# EAGLE design Sigfox_TH_sensor_v1.1 (EAGLE 9.6.2)
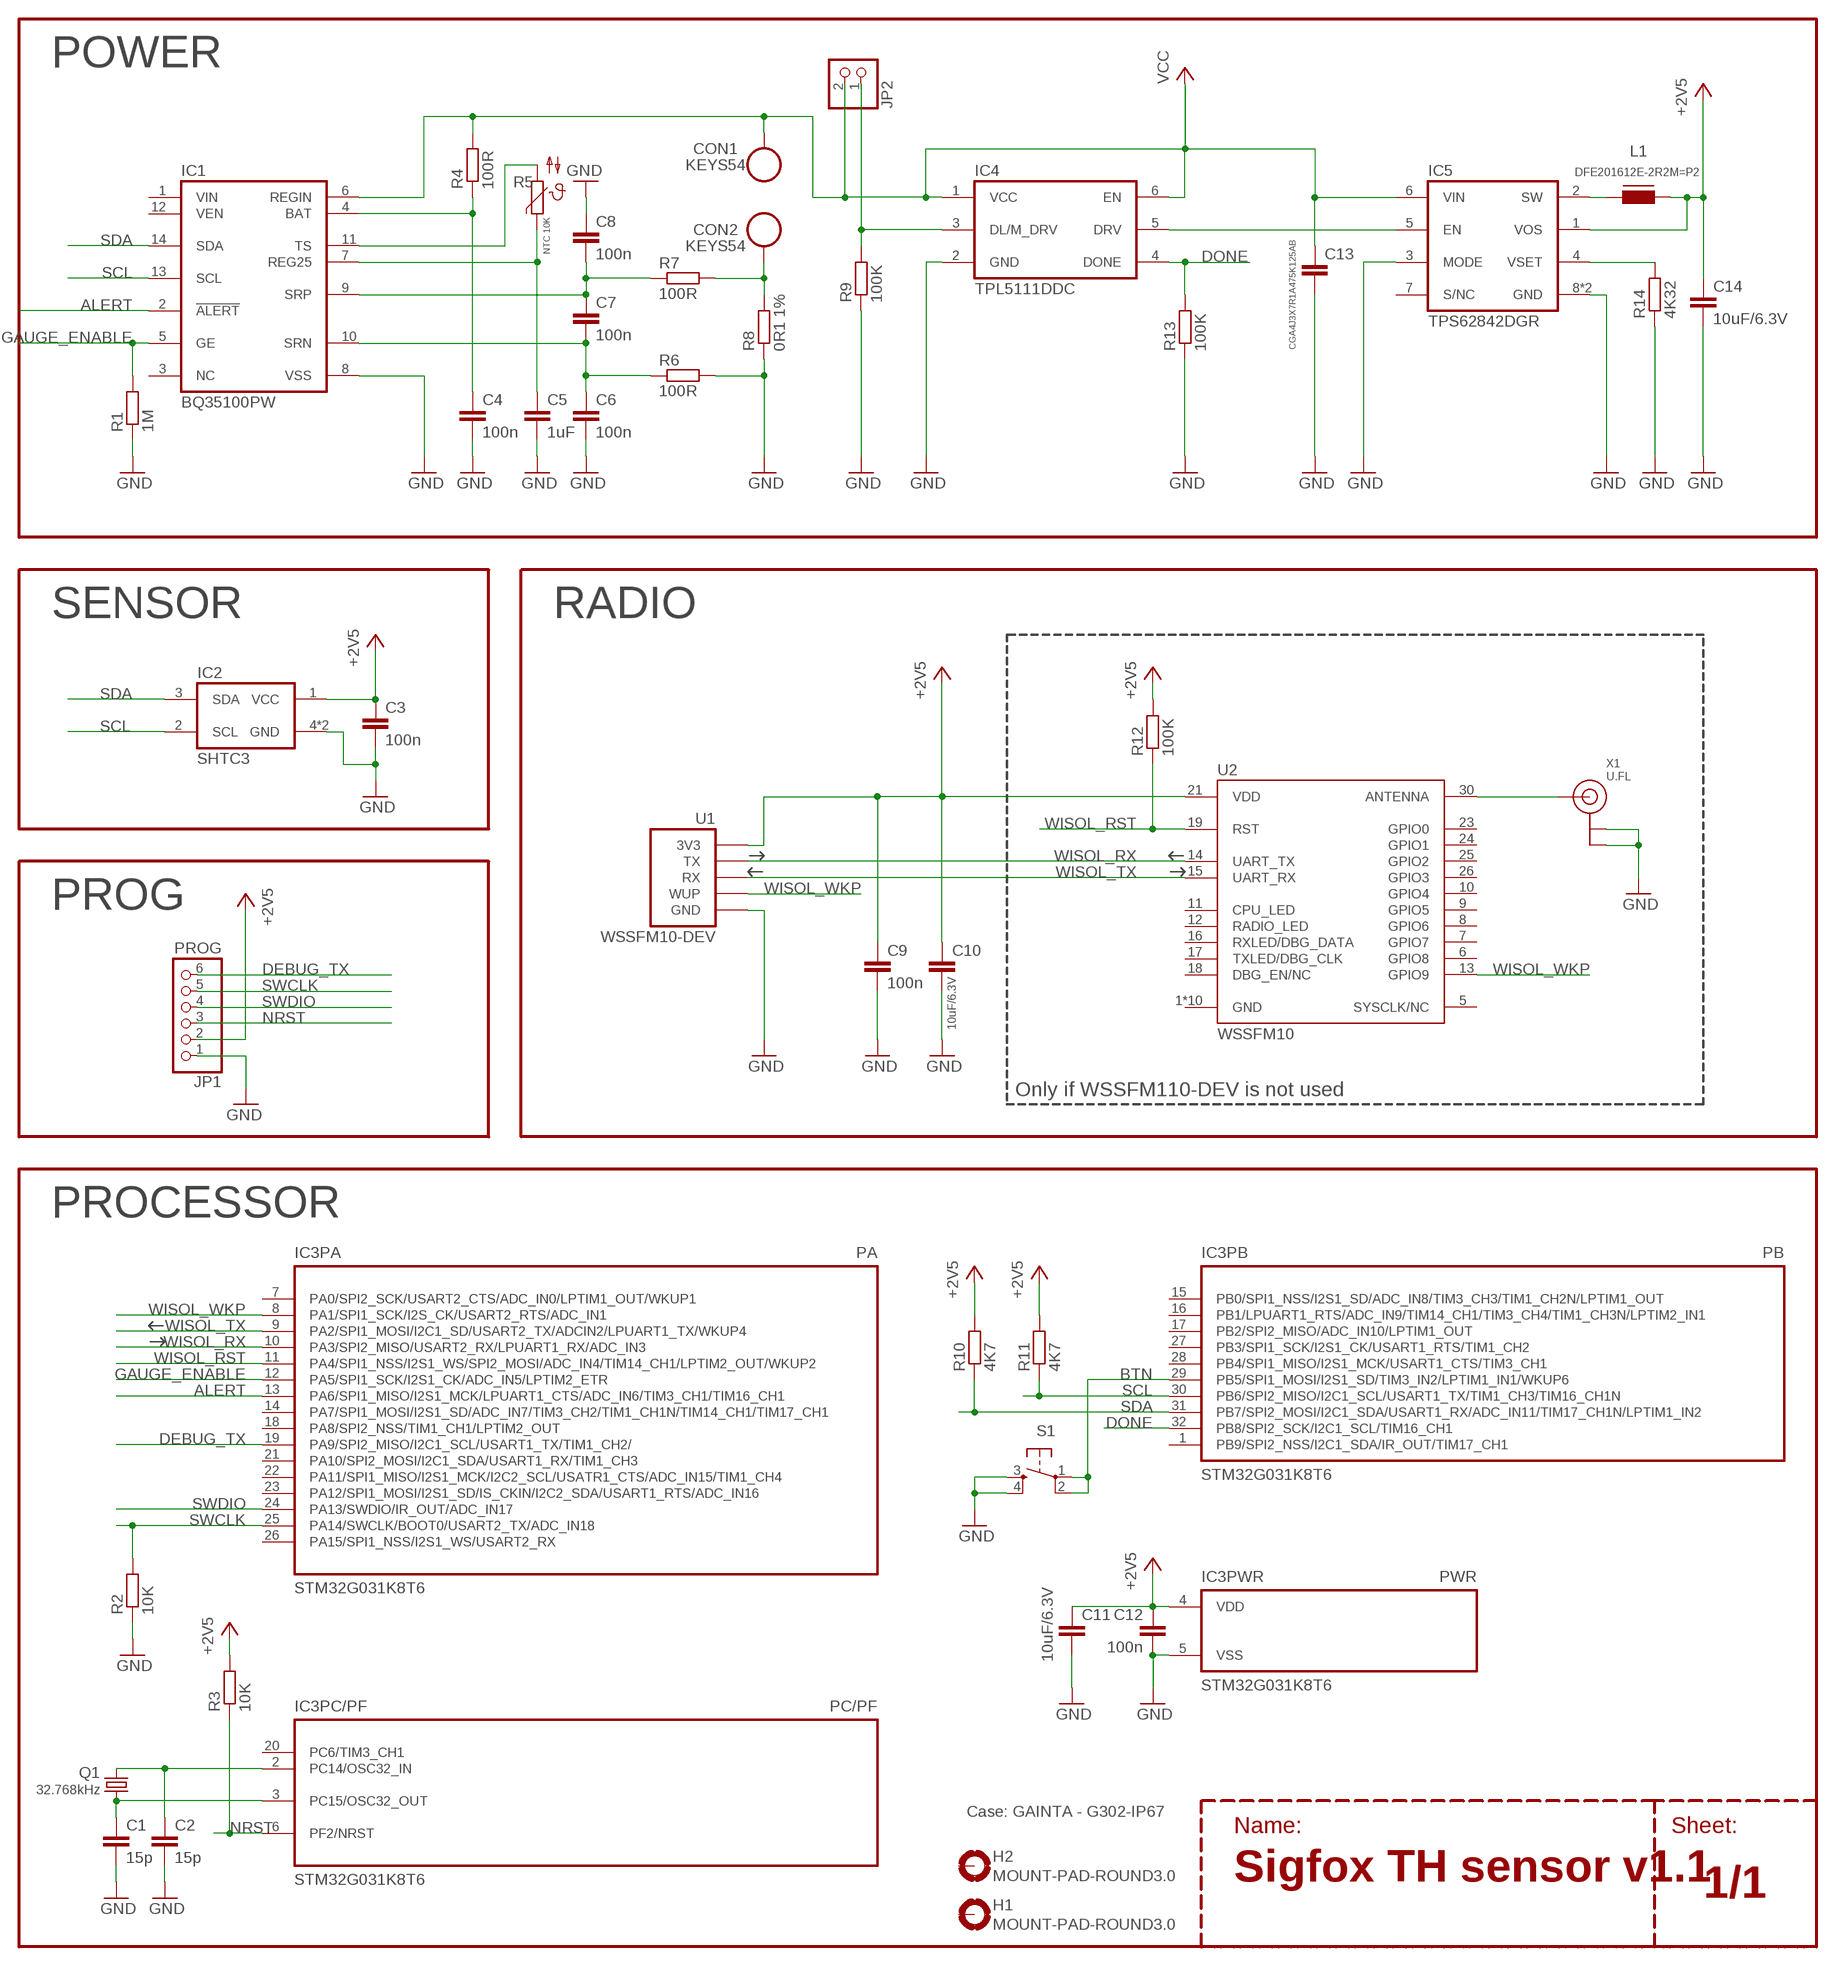
[diagram p0: schematic, sheet 1]

## Parts
C1  15p  C-EUC0805  [C0805]
C2  15p  C-EUC0805  [C0805]
C3  100n  C-EUC0805  [C0805]
C4  100n  C-EUC0805  [C0805]
C5  1uF  C-EUC0805  [C0805]
C6  100n  C-EUC0805  [C0805]
C7  100n  C-EUC0805  [C0805]
C8  100n  C-EUC0805  [C0805]
C9  100n  C-EUC0805  [C0805]
C10  10uF/6.3V  C-EUC0805  [C0805]
C11  10uF/6.3V  C-EUC0805  [C0805]
C12  100n  C-EUC0805  [C0805]
C13  CGA4J3X7R1A475K125AB  C-EUC0805  [C0805]
C14  10uF/6.3V  C-EUC0805  [C0805]
CON1  KEYS54  [KEYS54]
CON2  KEYS54  [KEYS54]
H1  MOUNT-PAD-ROUND3.0  [3,0-PAD]
H2  MOUNT-PAD-ROUND3.0  [3,0-PAD]
IC1  BQ35100PW  [TSSOP14]
IC2  SHTC3  [SON100P200X200X75-5T70X160N]
IC3  STM32G031K8T6  STM32G031  [TQFP32-08]
IC4  TPL5111DDC  [SOT23-6]
IC5  TPS62842DGR  [GHI-IC_MSOP-POWER.PAD-8(TI)]
JP1  PROG  PINHD-1X06_2.54-S  [1X06-S]
JP2  PINHD-1X02_2.00  [1X02M]
L1  DFE201612E-2R2M=P2  LQH2MPN2R2MGRL  [0806]
Q1  32.768kHz  CRYSTALMM20SS  [MM20SS]
R1  1M  R-EU_R0805  [R0805]
R2  10K  R-EU_R0805  [R0805]
R3  10K  R-EU_R0805  [R0805]
R4  100R  R-EU_R0805  [R0805]
R5  NTC 10K  NTCM-HP-10K-1%  [NTCM-HP]
R6  100R  R-EU_R0805  [R0805]
R7  100R  R-EU_R0805  [R0805]
R8  0R1 1%  R-EU_R1206  [R1206]
R9  100K  R-EU_R0805  [R0805]
R10  4K7  R-EU_R0805  [R0805]
R11  4K7  R-EU_R0805  [R0805]
R12  100K  R-EU_R0805  [R0805]
R13  100K  R-EU_R0805  [R0805]
R14  4K32  R-EU_R0805  [R0805]
S1  TACT_SWITCH-6X6X10-PTH  [TACTILE-6X6-PTH]
U1  WSSFM10-DEV  [WSSFM10-DEV]
U2  WSSFM10  [WSSFM10]
X1  U.FL  ANTENNA_U.FL  [U.FL]

## Nets
+2V5 [500mA]: C3.1 C9.1 C10.1 C11.1 C12.1 C14.1 IC2.1(VCC) IC3.4(PWR:VDD) IC5.1(VOS) JP1.2 L1.1 R3.2 R10.2 R11.2 R12.2 U1.3V3 U2.21(VDD)
ALERT: IC1.2(!ALERT!) IC3.13(PA:PA6/SPI1_MISO/I2S1_MCK/LPUART1_CTS/ADC_IN6/TIM3_CH1/TIM16_CH1)
BQ_2V5: C5.1 IC1.7(REG25) R5.1
BTN: IC3.29(PB:PB5/SPI1_MOSI/I2S1_SD/TIM3_IN2/LPTIM1_IN1/WKUP6) S1.1 S1.2
DEBUG_TX: IC3.19(PA:PA9/SPI2_MISO/I2C1_SCL/USART1_TX/TIM1_CH2/) JP1.6
DONE: IC3.32(PB:PB8/SPI2_SCK/I2C1_SCL/TIM16_CH1) IC4.4(DONE) R13.2
GAUGE_ENABLE: IC1.5(GE) IC3.12(PA:PA5/SPI1_SCK/I2S1_CK/ADC_IN5/LPTIM2_ETR) R1.2
GND: C1.2 C2.2 C3.2 C4.2 C5.2 C6.2 C8.1 C9.2 C10.2 C11.2 C12.2 C13.2 C14.2 IC1.8(VSS) IC2.4(GND) IC2.5(GND) IC3.5(PWR:VSS) IC4.2(GND) IC5.3(MODE) IC5.8(GND) IC5.9(GND) JP1.1 R1.1 R2.1 R6.2 R8.1 R9.1 R13.1 R14.1 S1.3 S1.4 U1.GND X1.1(GND) X1.2(GND)
N$1: IC5.4(VSET) R14.2
N$2: IC4.3(DL/M_DRV) JP2.1 R9.2
N$3: IC5.2(SW) L1.2
N$4: U2.30(ANTENNA) X1.3(SIGNAL)
N$6: C1.1 IC3.3(PC/PF:PC15/OSC32_OUT) Q1.4
N$7: IC4.5(DRV) IC5.5(EN)
N$8: C7.1 C8.2 IC1.9(SRP) R7.1
N$11: C6.1 C7.2 IC1.10(SRN) R6.1
N$12: C2.1 IC3.2(PC/PF:PC14/OSC32_IN) Q1.1
N$13: IC1.11(TS) R5.2
N$15: C4.1 IC1.4(BAT) R4.1
NRST: IC3.6(PC/PF:PF2/NRST) JP1.3 R3.1
PACK+: C13.1 CON1.1@0 CON1.1@1 CON1.1@2 IC1.6(REGIN) IC4.1(VCC) IC4.6(EN) IC5.6(VIN) JP2.2 R4.2 ; supply symbol labelled VCC
PACK-: CON2.1@0 CON2.1@1 CON2.1@2 R7.2 R8.2
SCL: IC1.13(SCL) IC2.2(SCL) IC3.30(PB:PB6/SPI2_MISO/I2C1_SCL/USART1_TX/TIM1_CH3/TIM16_CH1N) R11.1
SDA: IC1.14(SDA) IC2.3(SDA) IC3.31(PB:PB7/SPI2_MOSI/I2C1_SDA/USART1_RX/ADC_IN11/TIM17_CH1N/LPTIM1_IN2) R10.1
SWCLK: IC3.25(PA:PA14/SWCLK/BOOT0/USART2_TX/ADC_IN18) JP1.5 R2.2
SWDIO: IC3.24(PA:PA13/SWDIO/IR_OUT/ADC_IN17) JP1.4
WISOL_RST: IC3.11(PA:PA4/SPI1_NSS/I2S1_WS/SPI2_MOSI/ADC_IN4/TIM14_CH1/LPTIM2_OUT/WKUP2) R12.1 U2.19(RST)
WISOL_RX: IC3.10(PA:PA3/SPI2_MISO/USART2_RX/LPUART1_RX/ADC_IN3) U1.TX U2.14(UART_TX)
WISOL_TX: IC3.9(PA:PA2/SPI1_MOSI/I2C1_SD/USART2_TX/ADCIN2/LPUART1_TX/WKUP4) U1.RX U2.15(UART_RX)
WISOL_WKP: IC3.8(PA:PA1/SPI1_SCK/I2S_CK/USART2_RTS/ADC_IN1) U1.WUP U2.13(GPIO9)
Unconnected: H1.B3,0(MOUNT) H2.B3,0(MOUNT) IC1.1(VIN) IC1.3(NC) IC1.12(VEN) IC3.1(PB:PB9/SPI2_NSS/I2C1_SDA/IR_OUT/TIM17_CH1) IC3.7(PA:PA0/SPI2_SCK/USART2_CTS/ADC_IN0/LPTIM1_OUT/WKUP1) IC3.14(PA:PA7/SPI1_MOSI/I2S1_SD/ADC_IN7/TIM3_CH2/TIM1_CH1N/TIM14_CH1/TIM17_CH1) IC3.15(PB:PB0/SPI1_NSS/I2S1_SD/ADC_IN8/TIM3_CH3/TIM1_CH2N/LPTIM1_OUT) IC3.16(PB:PB1/LPUART1_RTS/ADC_IN9/TIM14_CH1/TIM3_CH4/TIM1_CH3N/LPTIM2_IN1) IC3.17(PB:PB2/SPI2_MISO/ADC_IN10/LPTIM1_OUT) IC3.18(PA:PA8/SPI2_NSS/TIM1_CH1/LPTIM2_OUT) IC3.20(PC/PF:PC6/TIM3_CH1) IC3.21(PA:PA10/SPI2_MOSI/I2C1_SDA/USART1_RX/TIM1_CH3) IC3.22(PA:PA11/SPI1_MISO/I2S1_MCK/I2C2_SCL/USATR1_CTS/ADC_IN15/TIM1_CH4) IC3.23(PA:PA12/SPI1_MOSI/I2S1_SD/IS_CKIN/I2C2_SDA/USART1_RTS/ADC_IN16) IC3.26(PA:PA15/SPI1_NSS/I2S1_WS/USART2_RX) IC3.27(PB:PB3/SPI1_SCK/I2S1_CK/USART1_RTS/TIM1_CH2) IC3.28(PB:PB4/SPI1_MISO/I2S1_MCK/USART1_CTS/TIM3_CH1) IC5.7(S/NC) U2.5(SYSCLK/NC) U2.6(GPIO8) U2.7(GPIO7) U2.8(GPIO6) U2.9(GPIO5) U2.10(GPIO4) U2.11(CPU_LED) U2.12(RADIO_LED) U2.16(RXLED/DBG_DATA) U2.17(TXLED/DBG_CLK) U2.18(DBG_EN/NC) U2.23(GPIO0) U2.24(GPIO1) U2.25(GPIO2) U2.26(GPIO3)

## Notes on the sheet
- POWER
- SENSOR | RADIO
- PROG
- Only if WSSFM110-DEV is not used
- PROCESSOR
- Case: GAINTA - G302-IP67
- Name: | Sheet:
- Sigfox TH sensor v1.1

## Power pins joined to a net without a drawn wire
GND: U2.1(GND) U2.2(GND) U2.3(GND) U2.4(GND) U2.20(GND) U2.22(GND) U2.27(GND) U2.28(GND) U2.29(GND) U2.31(GND)

## Library data of the parts
C1-C14 = rcl:C-EU: CAPACITOR, European symbol; SPICEPREFIX: C
CON1 CON2 = my-battery:KEYS54: KEYS 17-19mm battery clip
H1 H2 = holes:MOUNT-PAD-ROUND: MOUNTING PAD, round
IC1 = my-ic:BQ35100: Lithium Primary Battery Fuel Gauge and End-Of-Service Monitor; MSL: 2
IC2 = my-sensors:SHTC3: Humidity and Temperature Sensor
IC3 = my-processor:STM32G031?*: ARM®-Cortex®-M0+; MSL: 3
IC4 = my-power:TPL511*?: Nano-power System Timer
IC5 = my-power:TPS6284*?: Step-Down Converter 1.8-V to 6.5-V, 750-mA, 60-nA Iq
JP1 = pinhead-2:PINHD-1X06: PIN HEADER; NOTES: Neosazovat; SPOT-ON: SPOT-ON
JP2 = pinhead-2:PINHD-1X02: PIN HEADER
L1 = my-inductor:LQH2MPN*MGRL: Inductor; UH: 2.2
Q1 = crystal:CRYSTAL: CRYSTAL; OC_FARNELL: unknown; OC_NEWARK: unknown
R1-R4 R6-R14 = rcl:R-EU_: RESISTOR, European symbol; SPICEPREFIX: R
R5 = my-rcl:NTCM-HP-*-1%: NTC Thermistor
S1 = my-switch:TACT_SWITCH-6X6X*-?: 4pin Momentary Switch
U1 = my-modules:WSSFM10-DEV
U2 = my-modules:WSSFM10: WiSOL WSSFM10 Sigfox Module
X1 = adafruit:ANTENNA_U.FL: U.FL Antenna Connector

## Net classes
2 500mA: width 0.3 mm

## Board
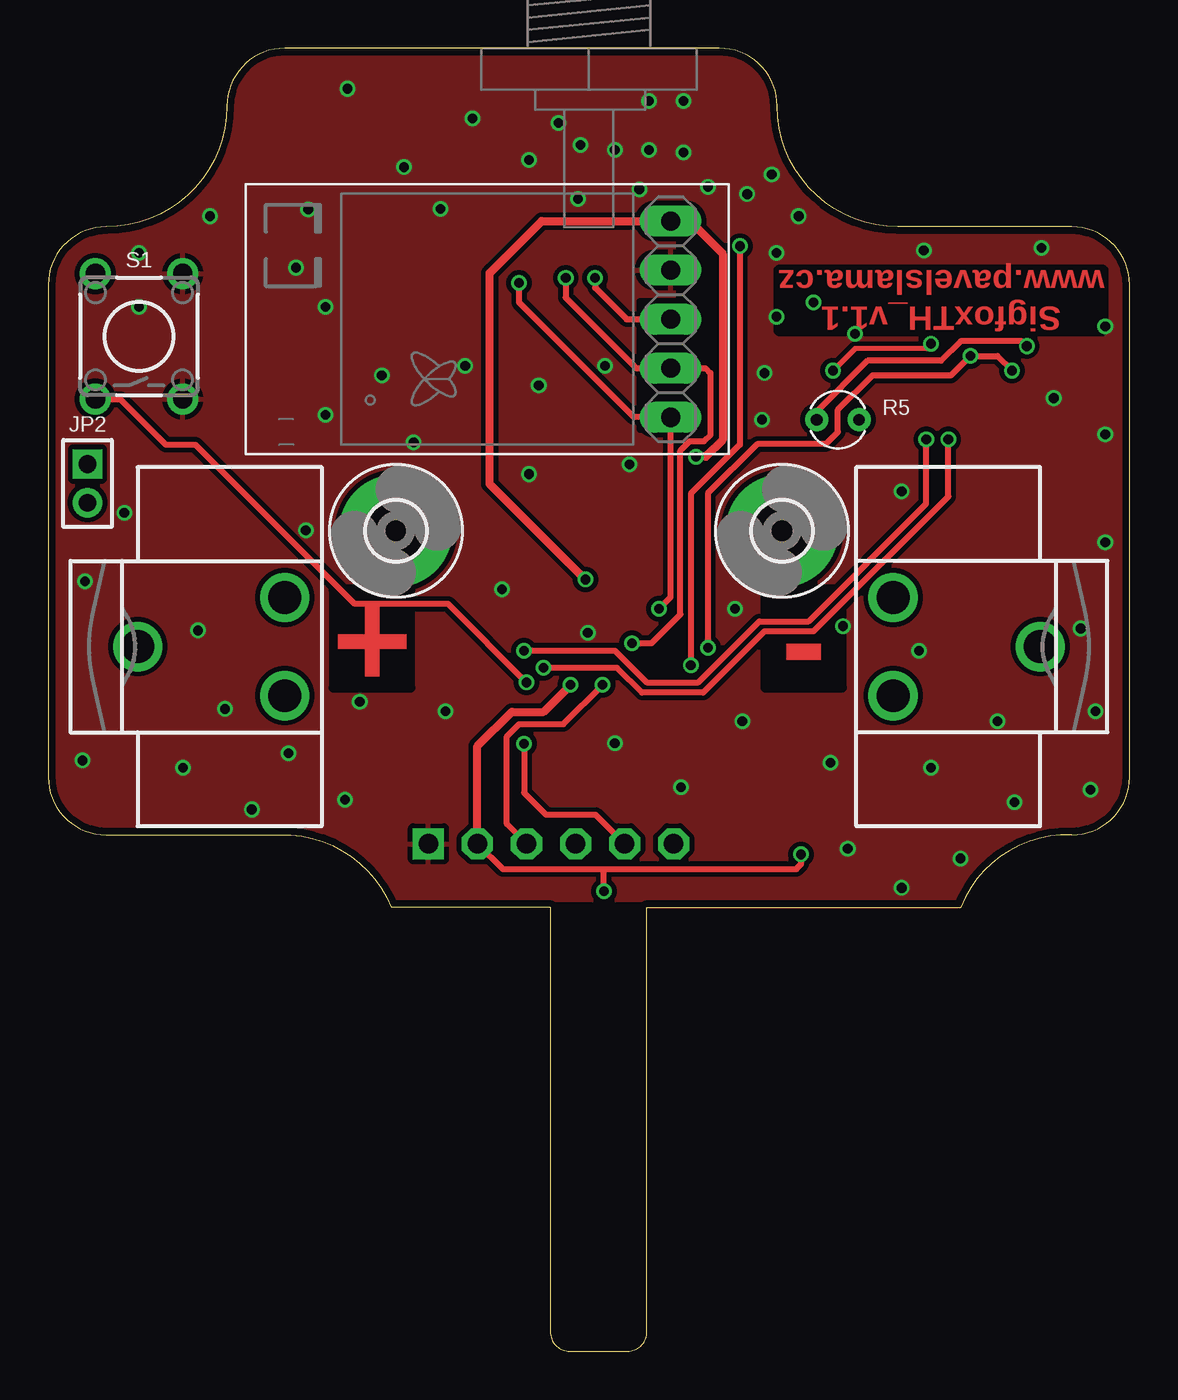
[diagram p1: board, top side]
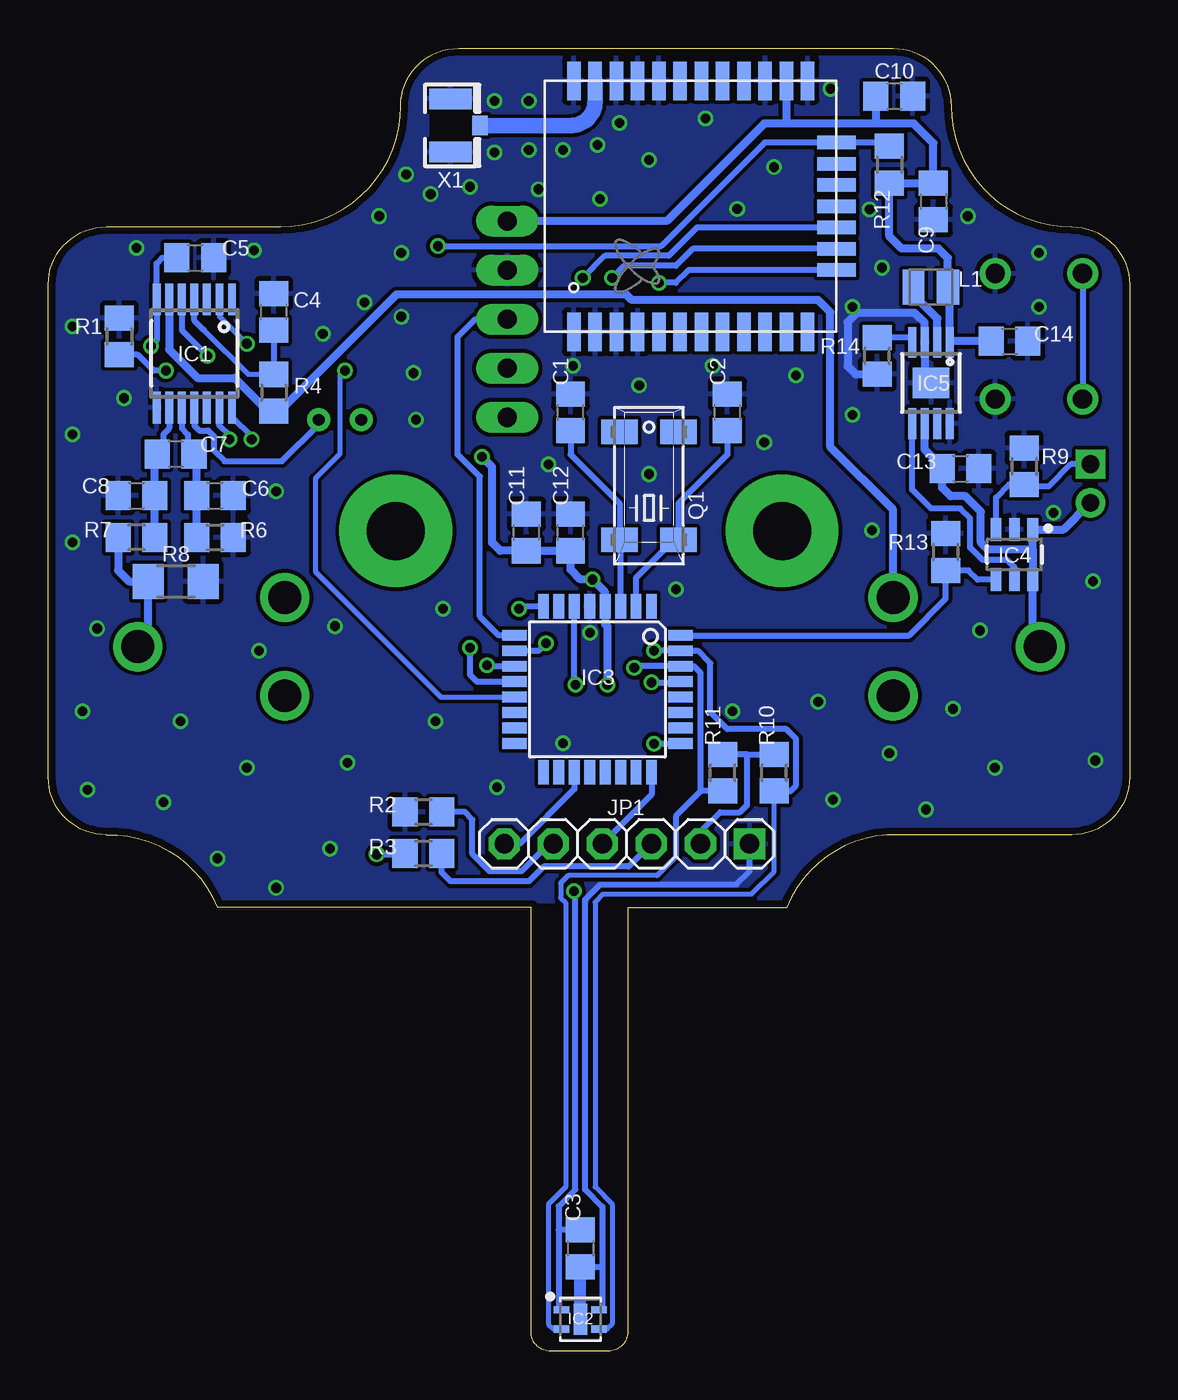
[diagram p2: board, bottom side, seen from below]

Size 56 x 67.5 mm. Coordinates in mm from the lower left corner, seen from the top.
Outline: 0,55.25 0,29.75 arc90 3,26.75 12,26.75 arc-70 17.75,23 26,23 26,1 arc90 27,0 30,0 arc90 31,1 31,23 47.25,23 arc-70 53,26.75 arc90 56,29.75 56,55.25 arc90 53,58.25 44,58.25 arc-90 37.75,64.5 arc90 34.75,67.5 12.25,67.5 arc90 9.25,64.5 arc-90 3,58.25 arc90 0,55.25
Copper layers (1*16): Top 0.035mm / dielectric 1.2mm / Bottom 0.035mm
Design rules "Elecrow_2-layer_optimal_PCB_eagle_rule *": minimum track width 6mil, minimum drill 12mil, track to track 6mil, track to pad 6mil, pad to pad 6mil, via to via 8mil, smd to smd 0mil, copper to edge 15mil, drill to drill 10mil, minimum pad ring 12mil, minimum via ring 6mil, stop-mask expansion 0mil, vias tented up to drill 100mil, thermal gap 10mil
bKeepout: 2 lines

### Footprints (pad centres in the part's own frame; a part is rotated, then mirrored left to right if it is on the bottom)
C0805 = smd 1.3 x 1.5: 1 -0.95,0; 2 0.95,0
KEYS54 = drill 1.7: 1@0 0,0; 1@1 7.62,2.54; 1@2 7.62,-2.54
3,0-PAD = drill 3 pad 5.842: B3,0 0,0
TSSOP14 = smd 0.4 x 1.65: 1 -1.95,-2.8; 2 -1.3,-2.8; 3 -0.65,-2.8; 4 0,-2.8; 5 0.65,-2.8; 6 1.3,-2.8; 7 1.95,-2.8; 8 1.95,2.8; 9 1.3,2.8; 10 0.65,2.8; 11 0,2.8; 12 -0.65,2.8; 13 -1.3,2.8; 14 -1.95,2.8
SON100P200X200X75-5T70X160N = smd 0.788 x 0.37: 1 -0.971,0.5; 2 -0.971,-0.5; 3 0.971,-0.5; 4 0.971,0.5 | smd 0.7 x 1.6: 5 0,0
TQFP32-08 = smd 1.27 x 0.559: 1 -4.293,2.8; 2 -4.293,2; 3 -4.293,1.2; 4 -4.293,0.4; 5 -4.293,-0.4; 6 -4.293,-1.2; 7 -4.293,-2; 8 -4.293,-2.8; 17 4.293,-2.8; 18 4.293,-2; 19 4.293,-1.2; 20 4.293,-0.4; 21 4.293,0.4; 22 4.293,1.2; 23 4.293,2; 24 4.293,2.8 | smd 0.559 x 1.27: 9 -2.8,-4.293; 10 -2,-4.293; 11 -1.2,-4.293; 12 -0.4,-4.293; 13 0.4,-4.293; 14 1.2,-4.293; 15 2,-4.293; 16 2.8,-4.293; 25 2.8,4.293; 26 2,4.293; 27 1.2,4.293; 28 0.4,4.293; 29 -0.4,4.293; 30 -1.2,4.293; 31 -2,4.293; 32 -2.8,4.293
SOT23-6 = smd 1.2 x 0.55: 1 -1.3,0.95; 2 -1.3,0; 3 -1.3,-0.95; 4 1.3,-0.95; 5 1.3,0; 6 1.3,0.95
GHI-IC_MSOP-POWER.PAD-8(TI) = smd 0.4 x 1.6: 1 -0.975,-2.1; 2 -0.325,-2.1; 3 0.325,-2.1; 4 0.975,-2.1; 5 0.975,2.1; 6 0.325,2.1; 7 -0.325,2.1; 8 -0.975,2.1 | smd 1.89 x 1.57: 9 0,0
1X06-S = drill 1 square: 1 -6.35,0 | drill 1 octagon: 2 -3.81,0; 3 -1.27,0; 4 1.27,0; 5 3.81,0; 6 6.35,0
1X02M = drill 0.914 square: 1 -1,0 | drill 0.914: 2 1,0
0806 = smd 1.165 x 1.815: 1 -0.875,0 | smd 1.115 x 1.815: 2 0.9,0
MM20SS = smd 1.27 x 1.88: 1 -2.794,-1.524; 2 2.794,-1.524; 3 2.794,1.524; 4 -2.794,1.524
R0805 = smd 1.3 x 1.5: 1 -0.95,0; 2 0.95,0
NTCM-HP = drill 0.6: 1 -1.1,0; 2 1.1,0
R1206 = smd 1.6 x 1.803: 1 -1.422,0; 2 1.422,0
TACTILE-6X6-PTH = drill 1: 1 -3.251,2.261; 2 3.251,2.261; 3 -3.251,-2.261; 4 3.251,-2.261
WSSFM10-DEV = drill 1 long: 3V3 5.08,-9.5; GND 2.54,-9.5; RX 0,-9.5; TX -2.54,-9.5; WUP -5.08,-9.5
WSSFM10 = smd 2 x 0.7: 1 -6.5,6.05; 2 -6.5,4.95; 3 -6.5,3.85; 4 -6.5,2.75; 5 -6.5,1.65; 6 -6.5,0.55; 7 -6.5,-0.55; 8 -6.5,-1.65; 9 -6.5,-2.75; 10 -6.5,-3.85; 11 -6.5,-4.95; 12 -6.5,-6.05; 20 6.5,-6.05; 21 6.5,-4.95; 22 6.5,-3.85; 23 6.5,-2.75; 24 6.5,-1.65; 25 6.5,-0.55; 26 6.5,0.55; 27 6.5,1.65; 28 6.5,2.75; 29 6.5,3.85; 30 6.5,4.95; 31 6.5,6.05 | smd 0.7 x 2: 13 -3.3,-7.55; 14 -2.2,-7.55; 15 -1.1,-7.55; 16 0,-7.55; 17 1.1,-7.55; 18 2.2,-7.55; 19 3.3,-7.55
U.FL = smd 2.2 x 1.05: 1 0,1.375; 2 0,-1.375 | smd 0.8 x 1: 3 1.525,0

### Placement (x,y rotation side)
C1  28.96,48.64 90 bottom
C2  20.83,48.64 90 bottom
C3  28.45,5.33 270 bottom
C4  44.32,53.85 90 bottom
C5  48.39,56.64 0 bottom
C6  47.37,44.32 0 bottom
C7  49.4,46.48 0 bottom
C8  51.44,44.32 0 bottom
C9  10.16,59.56 270 bottom
C10  12.19,65.02 0 bottom
C11  31.24,42.42 90 bottom
C12  28.96,42.42 90 bottom
C13  8.76,45.72 0 bottom
C14  6.22,52.32 0 bottom
CON1  4.63,36.5 0 top
CON2  51.37,36.5 180 top
CONN  SMA-PIGTAIL  [SMA-PIGTAIL]  28,67.5 270 top
H1  18,42.5 0 top
H2  38,42.5 0 top
IC1  48.44,51.69 180 bottom
IC2  28.45,1.65 0 bottom
IC3  27.56,34.29 270 bottom
IC4  5.97,41.27 270 bottom
IC5  10.29,50.16 180 bottom
JP1  26.04,26.29 180 bottom
JP2  2.03,44.96 270 top
L1  10.29,55.12 180 bottom
Q1  24.89,44.83 90 bottom
R1  52.32,52.58 270 bottom
R2  36.58,27.94 0 bottom
R3  36.58,25.78 180 bottom
R4  44.32,49.66 270 bottom
R5  40.89,48.26 0 top
R6  47.37,42.16 0 bottom
R7  51.44,42.16 180 bottom
R8  49.4,39.88 180 bottom
R9  5.46,45.85 270 bottom
R10  18.41,29.97 90 bottom
R11  21.08,29.97 90 bottom
R12  12.45,61.47 270 bottom
R13  9.53,41.4 270 bottom
R14  13.08,51.56 90 bottom
S1  4.7,52.58 90 top
U1  22.73,53.47 90 top
U2  22.73,59.31 90 bottom
X1  35.18,63.5 0 bottom

### Tracks (layer width: path | path; a pad name or v marks a point on that pad's centre or on a via)
+2V5  (via drill 0.5)
  Top 0.305: JP1.2 23.54,24.98 28.78,24.98 | 28.78,24.98 38.73,24.98 38.99,25.23 v38.99,25.74 | v28.78,23.82 28.78,24.98
  Top 0.406: JP1.2 22.23,31.34 24,33.12 25.65,33.12 v27.05,34.52 | v27.81,39.98 22.86,44.93 22.86,55.85 25.55,58.55 U1.3V3 33.25,58.55 34.92,56.87 34.92,47.21 34.05,46.34 v33.54,46.34
  Bottom 0.305: JP1.2 22.23,26.9 21.21,27.91 20.19,27.91 19.81,28.3 19.81,30.92 | v38.99,25.74 37.57,25.74 R3.2 | 19.81,30.92 R11.2 | 19.81,30.92 R10.2 | IC2.1 29.57,2.15 29.57,6.28 | v28.78,23.82 28.7,23.75 28.7,8.38 29.57,7.52 29.57,6.28 | C3.1 29.57,6.28
  Bottom 0.406: 13.08,63.6 11.18,63.6 10.16,62.59 C9.1 R12.2 12.45,57.76 11.81,57.12 9.91,57.12 9.41,56.63 L1.1 9.31,55.02 IC5.1 9.25,52.32 C14.1 | 13.08,63.6 13.14,63.66 C10.1 | 17.78,63.6 U2.21 | 13.08,63.6 17.78,63.6 | v27.05,34.52 27.05,37.56 27.16,37.67 IC3.4 27.16,39.33 v27.81,39.98 28.45,39.98 28.96,40.49 C12.1 C11.1 32.6,41.47 33.02,41.88 33.02,45.81 v33.54,46.34 | 17.78,63.6 18.92,63.6 23.98,58.55 U1.3V3
ALERT  (via drill 0.5)
  Top 0.254: v45.72,52.2 45.47,51.94 41.78,51.94 v40.64,50.8
  Bottom 0.254: IC1.2 47.14,53.62 v45.72,52.2 | v40.64,50.8 40.89,50.55 40.89,46.48 42.16,45.21 42.16,40.39 35.67,33.89 IC3.13
BQ_2V5  (via drill 0.5)
  Top 0.305: R5.1 39.79,48.68 42.42,51.31 46.23,51.31 47.24,52.32 50.42,52.32 v50.67,52.07
  Bottom 0.305: C5.1 50.1,56.64 50.39,56.35 IC1.7 50.39,52.35 v50.67,52.07
BTN  (via drill 0.5)
  Top 0.305: S1.1 3.73,49.33 6.1,46.96 7.62,46.96 15.88,38.71 20.7,38.71 v24.77,34.65
  Bottom 0.305: S1.2 S1.1 | v24.77,34.65 23.31,34.65 IC3.29
DEBUG_TX
  Bottom 0.305: IC3.19 28.76,29.13 31.6,26.29 JP1.6
DONE
  Bottom 0.305: IC4.4 7.87,39.98 8.35,40.45 R13.2 9.53,38.99 11.42,37.09 IC3.32
GAUGE_ENABLE  (via drill 0.5)
  Top 0.305: v34.16,36.45 34.16,44.45 36.7,46.99 40.26,46.99 40.89,47.62 40.89,48.77 42.67,50.55 46.74,50.55 v47.75,51.56 49.15,51.56 v49.91,50.8
  Bottom 0.305: v34.16,36.45 34.16,35.05 33.8,34.69 IC3.12 | IC1.5 49.09,52.9 v47.75,51.56 | v49.91,50.8 50.55,50.8 51.37,51.63 R1.2
GND  (via drill 0.5)
  Bottom 0.305: JP1.1 19.68,24.87 20.37,24.18 27.41,24.18 28.19,23.39 28.19,8.38 27.3,7.49 27.3,4.38 | C3.2 27.3,4.38 | 27.3,4.38 27.3,2.15 IC2.4
  Bottom 0.406: IC5.9 10.61,50.49 IC5.3 10.61,53.29 10.89,53.57 10.92,53.57 11.13,53.78 14.14,53.78 14.61,53.31 14.61,51.03 14.19,50.61 R14.1
  Bottom 0.61: IC2.5 C3.2
  other vias: 32.89,62.1 31.11,62.23 29.34,62.23 27.56,62.48 32.89,64.77 31.11,64.77 26.42,63.63 34.16,60.33 36.2,59.94 37.47,60.96 3.94,43.43 27.94,37.21 30.1,45.95 37.72,53.59 28.83,51.05 25.4,50.04 38.86,58.8 37.72,56.9 45.34,57.02 51.44,57.15 37.08,50.67 41.78,52.7 36.96,48.26 27.43,59.69 24.89,61.72 21.97,63.85 13.46,59.16 30.61,60.2 18.41,61.34 20.32,59.18 12.83,56.13 14.35,54.1 15.49,65.41 8.38,58.8 4.7,56.9 4.7,54.1 14.35,48.51 17.27,50.55 18.92,47.09 13.34,42.52 23.5,39.47 7.75,37.34 16.13,33.66 6.99,30.23 1.78,30.61 1.91,39.88 9.14,33.27 15.37,28.57 12.45,30.99 10.54,28.07 32.77,29.21 35.56,38.45 41.15,37.57 35.94,32.64 40.51,30.48 45.09,36.3 49.15,32.64 44.2,44.55 45.72,30.23 41.4,26.04 47.24,25.53 50.04,28.45 53.98,29.08 54.23,33.15 39.62,54.33 52.07,49.38 53.47,37.44 54.74,47.5 54.74,41.91 54.74,53.09 44.2,24 29.34,31.5 24.89,45.44 20.57,33.15 21.59,51.05
  pour Bottom (isolate 0.2): 3,26.75 arc-90 0,29.75 0,55.25 arc-90 3,58.25 arc90 9.25,64.5 arc-90 12.25,67.5 34.75,67.5 arc-90 37.75,64.5 arc90 44,58.25 53,58.25 arc-90 56,55.25 56,29.75 arc-90 53,26.75 arc70 47.25,23 31,23 26,23 17.75,23 arc70 12,26.75
  pour Top (isolate 0.254): 0,55.25 0,29.75 arc90 3,26.75 12,26.75 arc-70 17.75,23 47.25,23 arc-70 53,26.75 arc90 56,29.75 56,55.25 arc90 53,58.25 44,58.25 arc-90 37.75,64.5 arc90 34.75,67.5 12.25,67.5 arc90 9.25,64.5 arc-90 3,58.25 arc90
  cutout Top: 30.61,47.71 30.61,54.44 32.64,54.44 32.64,57.49 34.54,57.49 34.54,47.71
  cutout Top: 17.88,23.16 47.35,23.16 47.35,23.04
  cutout Bottom: 47.35,23.11 17.88,23.11 17.88,23.09 47.35,23.09
N$1
  Bottom 0.305: IC5.4 11.26,52.51 R14.2
N$2
  Bottom 0.305: IC4.3 6.92,44.24 6.26,44.9 R9.2 5.46,44.8 4.19,44.8 3.04,45.96 JP2.1
N$3
  Bottom 0.406: IC5.2 9.96,53.5 11.19,54.72 L1.2
N$4
  Bottom 0.8: U2.30 27.68,64.74 arc90 28.93,63.5 X1.3
N$6
  Bottom 0.305: IC3.3 26.36,41.98 Q1.4 26.42,43.92 28.96,46.46 C1.1
N$7
  Bottom 0.305: IC5.5 11.26,44.64 10.29,43.66 8.76,43.66 8.26,43.15 8.26,41.63 7.62,40.99 6.35,40.99 5.97,40.61 IC4.5
N$8
  Bottom 0.305: IC1.9 49.74,47.8 50.04,47.5 50.04,46.48 C7.1
  Bottom 0.406: R7.1 C8.2 50.48,46.35 C7.1
N$11
  Bottom 0.305: IC1.10 49.09,47.82 48.77,47.5 48.77,46.48 C7.2
  Bottom 0.406: R6.1 C6.1 48.32,46.35 C7.2
N$12
  Bottom 0.305: IC3.2 25.56,40.07 23.6,42.04 Q1.1 23.37,43.92 20.83,46.46 C2.1
N$13
  Bottom 0.305: IC1.11 48.44,47.95 48.18,47.7 47.73,47.7 47.42,47.4 47.42,46.66 46.86,46.1 43.9,46.1 41.99,48.01 R5.2
N$15
  Bottom 0.254: 47.95,52.9 45.65,50.61 R4.1
  Bottom 0.305: C4.1 R4.1 | IC1.4 48.44,53.39 47.95,52.9
NRST  (via drill 0.5)
  Top 0.305: JP1.3 23.75,27.3 23.75,31.85 24.38,32.49 26.67,32.49 v28.7,34.52
  Bottom 0.305: v28.7,34.52 28.76,34.58 IC3.6 | R3.1 35.63,24.8 35.16,24.34 31.11,24.34 30.35,25.11 25.95,25.11 JP1.3
PACK+
  Bottom 0.406: IC5.6 10.61,46.72 9.71,45.82 C13.1 9.71,44.74 9.27,44.3 8.51,44.3 7.7,43.49 7.7,41.88 7.37,41.55 5.02,41.55 | CON1.1@0 5.02,36.89 IC4.6 5.02,41.55 | CON1.1@1 12.25,43.59 15.49,46.84 15.49,53.82 16.13,54.46 25.78,54.46 26.06,54.74 37.97,54.74 44,48.71 R4.2 44.64,48.71 46.35,50.42 48.26,50.42 49.74,51.9 IC1.6 | 5.02,41.55 IC4.1 3.42,42.58 JP2.2
PACK-
  Bottom 0.406: CON2.1@0 50.83,37.05 R8.2 51.82,39.88 52.38,40.45 R7.2
SCL  (via drill 0.5)
  Top 0.305: v25.65,35.41 29.46,35.41 30.75,34.12 33.91,34.12 37.08,37.3 39.62,37.3 46.61,44.28 v46.61,47.24
  Bottom 0.254: 23.5,25.61 24.47,24.64 29.08,24.64 29.46,24.26 29.46,23.5 29.21,23.24 29.21,8.51 30.1,7.62 30.1,1.4 29.85,1.15 IC2.2
  Bottom 0.305: 22.23,29.02 22.23,35.15 22.56,35.49 IC3.30 25.57,35.49 v25.65,35.41 | 22.23,29.02 22.23,29 23.5,27.73 23.5,25.61 | R11.1 22.23,29.02 | v46.61,47.24 46.61,47.42 47.14,47.95 IC1.13
SDA  (via drill 0.5)
  Top 0.305: v24.64,36.3 29.34,36.3 30.99,34.65 33.67,34.65 36.83,37.8 39.37,37.8 45.47,43.9 v45.47,47.24
  Bottom 0.254: R10.1 18.41,24.85 19.58,23.68 27.28,23.68 27.69,23.28 27.69,8.51 26.8,7.62 26.8,1.4 27.04,1.15 IC2.3
  Bottom 0.305: R10.1 17.56,29.02 17.27,29.31 17.27,31.72 17.78,32.23 20.83,32.23 21.72,33.12 21.72,35.63 22.38,36.29 IC3.31 v24.63,36.29 v24.64,36.3 | v45.47,47.24 45.47,47.37 46.49,48.39 IC1.14
SWCLK  (via drill 0.5)
  Top 0.305: v24.64,31.47 24.64,28.93 25.78,27.79 28.35,27.79 JP1.5
  Bottom 0.305: v24.64,31.47 24.62,31.49 IC3.25 | JP1.5 30.07,26.29 31.5,24.87 33.15,24.87 34.04,25.75 34.04,27.53 34.44,27.94 R2.2
SWDIO
  Bottom 0.305: IC3.24 24.76,28.84 JP1.4
WISOL_RST  (via drill 0.5)
  Top 0.305: v35.81,57.25 35.81,46.96 33.27,44.42 v33.27,35.53
  Bottom 0.305: R12.1 12.64,62.61 U2.19 18.9,62.61 24.26,57.25 v35.81,57.25 | v33.27,35.53 33.23,35.49 IC3.11
WISOL_RX  (via drill 0.5)
  Top 0.305: v30.23,36.68 31.24,36.68 32.74,38.17 32.74,46.66 33.21,47.14 33.96,47.14 34.29,47.47 34.29,50.67 34.04,50.93 U1.TX 30.45,50.93 26.8,54.58 v26.8,55.6
  Bottom 0.305: IC3.10 30.61,36.29 v30.23,36.68 | U2.14 22.62,57.11 23.5,56.23 26.16,56.23 v26.8,55.6
WISOL_TX  (via drill 0.5)
  Top 0.305: v28.32,55.6 28.32,55.09 29.95,53.47 U1.RX
  Bottom 0.305: IC3.9 32.67,37.09 33.66,38.07 33.66,45.31 34.8,46.46 34.8,52.55 33.88,53.47 U1.RX | U2.15 22.41,58.21 23.88,56.74 27.18,56.74 v28.32,55.6
WISOL_WKP  (via drill 0.5)
  Top 0.305: v31.62,38.45 32.23,39.06 U1.WUP 30.33,48.39 24.38,54.33 v24.38,55.35
  Bottom 0.305: IC3.8 31.5,38.58 v31.62,38.45 | v24.38,55.35 23.5,55.35 22.83,56.01 U2.13

### Text on the board
Top: SigfoxTH_v1.1 / www.pavelslama.cz | + | -
tStop: + | -